# EAGLE design GPS Antenna Test (EAGLE 9.2.1)
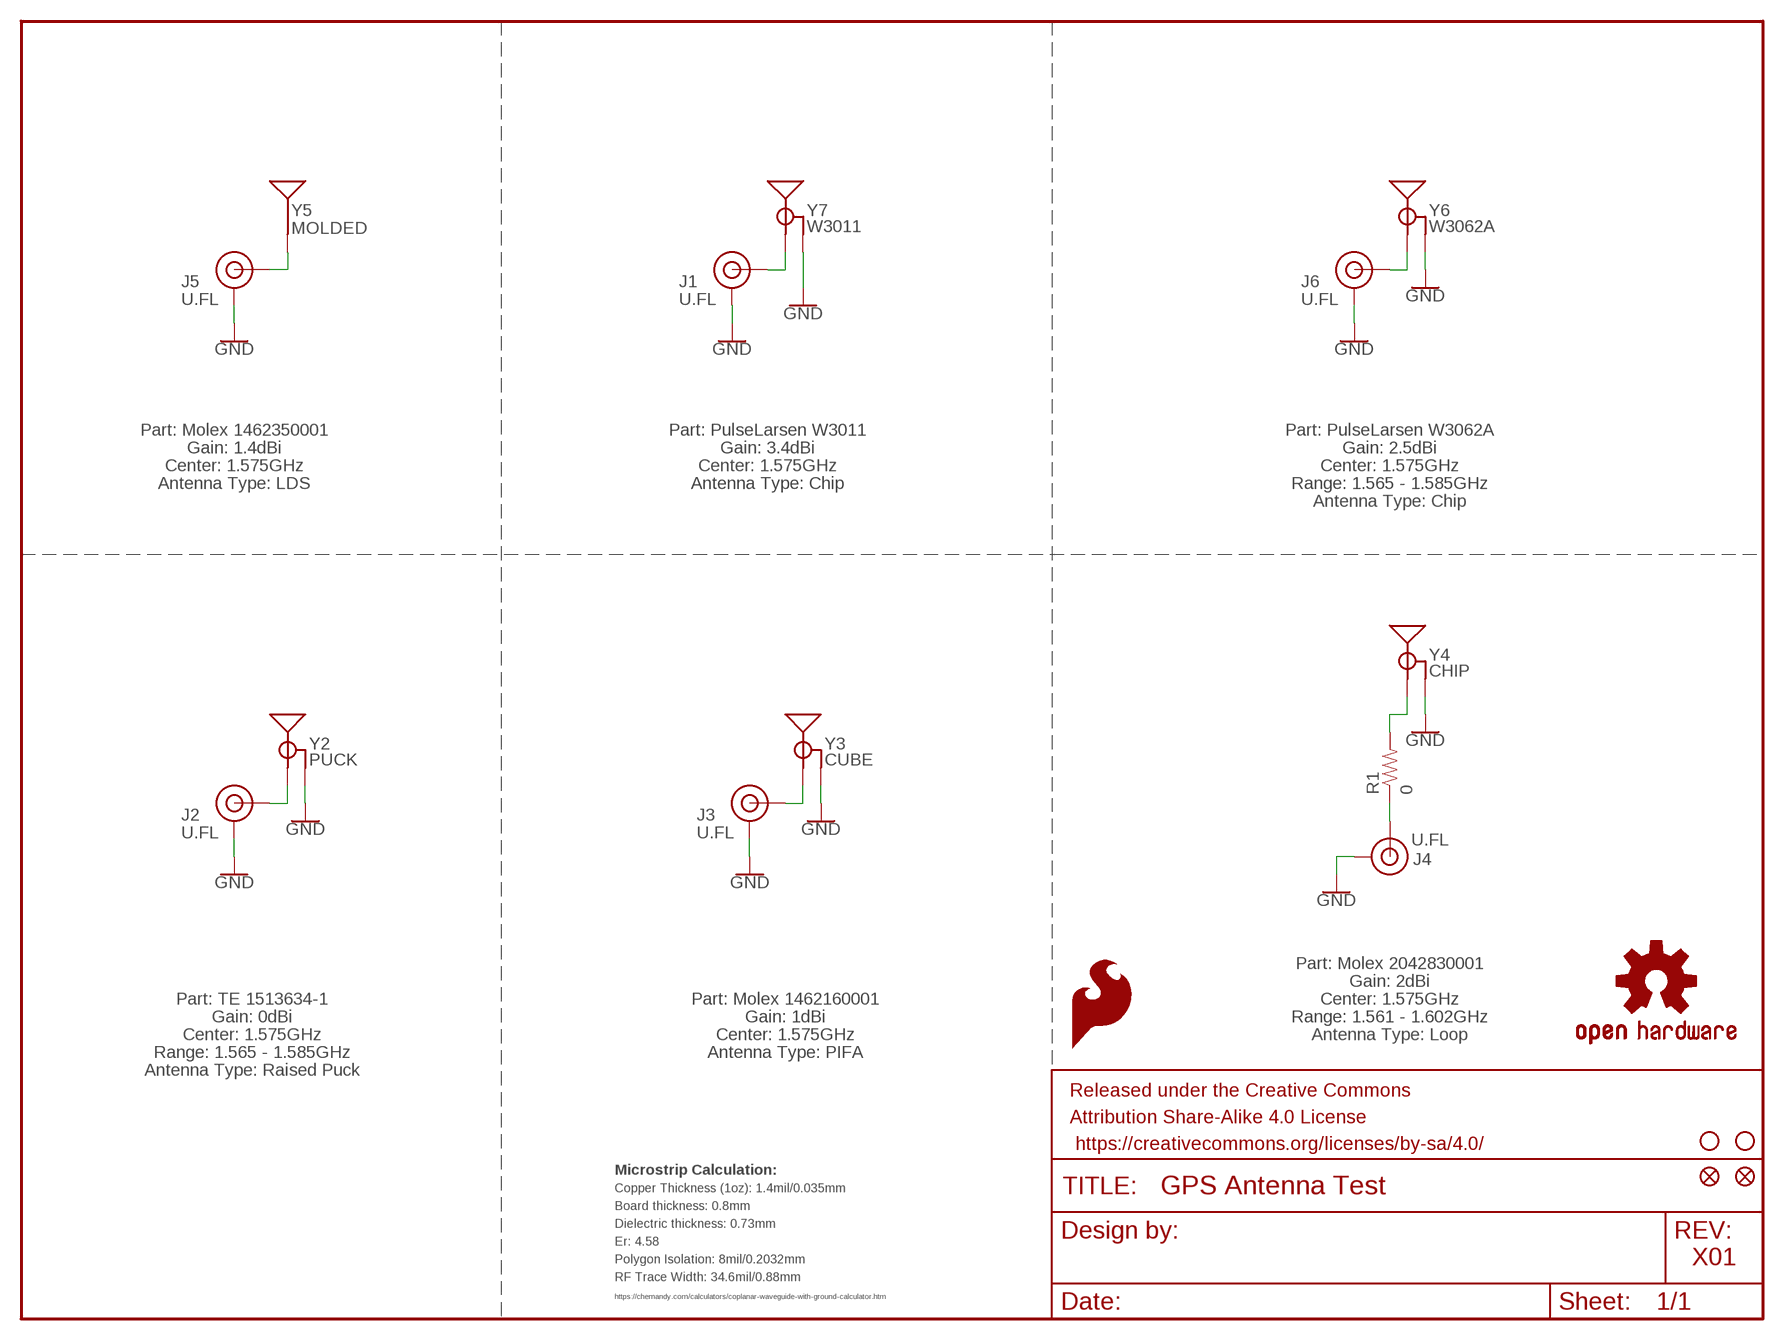
[diagram p0: schematic, sheet 1]

## Parts
FRAME1  FRAME-LETTER  [CREATIVE_COMMONS]
J1  U.FL  U.FL2PIN  [U.FL]
J2  U.FL  U.FL2PIN  [U.FL]
J3  U.FL  U.FL2PIN  [U.FL]
J4  U.FL  U.FL2PIN  [U.FL]
J5  U.FL  U.FL2PIN  [U.FL]
J6  U.FL  U.FL2PIN  [U.FL]
JP5  STAND-OFF  [STAND-OFF]
JP6  STAND-OFF  [STAND-OFF]
JP8  FIDUCIAL1X2  [FIDUCIAL-1X2]
JP9  FIDUCIAL1X2  [FIDUCIAL-1X2]
LOGO1  SFE_LOGO_FLAME.1EXP  [SFE_LOGO_FLAME_COPPER_EXPOSED_.1]
LOGO2  SFE_LOGO_FLAME.1EXP  [SFE_LOGO_FLAME_COPPER_EXPOSED_.1]
LOGO3  SFE_LOGO_FLAME.1EXP  [SFE_LOGO_FLAME_COPPER_EXPOSED_.1]
LOGO4  SFE_LOGO_FLAME.1EXP  [SFE_LOGO_FLAME_COPPER_EXPOSED_.1]
LOGO5  SFE_LOGO_FLAME.1EXP  [SFE_LOGO_FLAME_COPPER_EXPOSED_.1]
LOGO6  SFE_LOGO_FLAME.1EXP  [SFE_LOGO_FLAME_COPPER_EXPOSED_.1]
R1  0  RESISTOR0402-RES  [0402-RES]
U$16  OSHW-LOGOS  [OSHW-LOGO-S]
Y2  PUCK  GPS_CHIP_ANTENNAPUCK  [TE_PUCK]
Y3  CUBE  GPS_CHIP_ANTENNACUBE  [MOLEX_GNSS_CUBE]
Y4  CHIP  GPS_CHIP_ANTENNA2042830001  [MOLEX_GNSS_CHIP]
Y5  MOLDED  GPS_CHIP_ANTENNA_NOGNDMOLDED  [MLOEX_GNSS_MOLDED]
Y6  W3062A  GPS_CHIP_ANTENNAW3062A  [W3062A]
Y7  W3011  GPS_CHIP_ANTENNAW3011  [W3011]

## Nets
FEED1: J1.FEED(SIGNAL) Y7.1(SIGNAL)
FEED2: J5.FEED(SIGNAL) Y5.FEED(SIGNAL)
FEED3: J2.FEED(SIGNAL) Y2.S(SIGNAL)
FEED4: J3.FEED(SIGNAL) Y3.FEED(SIGNAL)
FEED5: J4.FEED(SIGNAL) R1.1
FEED6: J6.FEED(SIGNAL) Y6.FEED(SIGNAL)
GND: J1.1(GND) J1.2(GND) J2.1(GND) J2.2(GND) J3.1(GND) J3.2(GND) J4.1(GND) J4.2(GND) J5.1(GND) J5.2(GND) J6.1(GND) J6.2(GND) Y2.1(GND) Y2.2(GND) Y2.3(GND) Y3.GND Y4.1(GND) Y4.2(GND) Y4.3(GND) Y6.GND Y7.2(GND) Y7.3(GND)
N$5: R1.2 Y4.FEED(SIGNAL)

## Notes on the sheet
- Part: Molex 1462350001 | Part: PulseLarsen W3011 | Part: PulseLarsen W3062A
- Gain: 1.4dBi | Gain: 3.4dBi | Gain: 2.5dBi
- Center: 1.575GHz | Center: 1.575GHz | Center: 1.575GHz
- Antenna Type: LDS | Antenna Type: Chip | Range: 1.565 - 1.585GHz
- Antenna Type: Chip
- Part: Molex 2042830001
- Gain: 2dBi
- Part: TE 1513634-1 | Part: Molex 1462160001 | Center: 1.575GHz
- Gain: 0dBi | Gain: 1dBi | Range: 1.561 - 1.602GHz
- Center: 1.575GHz | Center: 1.575GHz | Antenna Type: Loop
- Range: 1.565 - 1.585GHz | Antenna Type: PIFA
- Antenna Type: Raised Puck
- Microstrip Calculation:
- Copper Thickness (1oz): 1.4mil/0.035mm
- Board thickness: 0.8mm
- Dielectric thickness: 0.73mm
- Er: 4.58
- Polygon Isolation: 8mil/0.2032mm | X01
- RF Trace Width: 34.6mil/0.88mm
- https://chemandy.com/calculators/coplanar-waveguide-with-ground-calculator.htm

## Library data of the parts
FRAME1 = SparkFun-Aesthetics:FRAME-LETTER: Schematic Frame - Letter Standard 8.5x11 US Letter frame
J1-J6 = SparkFun-Connectors:U.FL2PIN: SMD Antenna Connector - U.FL 2mm height, 3.0mm x 3.0mm receptacle size. SparkFun Products: SparkFun WiFi Shield - ESP8266 <https://www.sparkfun.com/products/13287> SparkFun ESP8266 Thing <https://www.sparkfun.com/products/13231> SparkFun MiniGen - Pro Mini Signal Generator Shield <https://www.sparkfun.com/products/11420>; PROD_ID: CONN-09193; SF_ID: WRL-09144
JP5 JP6 = SparkFun:STAND-OFF: Stand Off This is the mechanical footprint for a #4 phillips button head screw. Use the keepout ring to avoid running the screw head into surrounding components. SKU : PRT-00447
JP8 JP9 = SparkFun:FIDUCIAL: Fiducial Alignment Points Various fiducial points for machine vision alignment.
LOGO1-LOGO6 = SparkFun-Aesthetics:SFE_LOGO_FLAME: SparkFun Flame Logo This is the SparkFun flame logo. The logo on the schematic will always be the same size; the package variant is the height of the flame. Default layer for the logo on the board is tSilk.
R1 = Testing:RESISTOR: Resistor Basic schematic elements and footprints for 0603, 1206, and PTH resistors.
U$16 = SparkFun-Aesthetics:OSHW-LOGO: Open-Source Hardware (OSHW) Logo This logo indicates the piece of hardware it is found on incorporates a OSHW license and/or adheres to the definition of open source hardware found here: http://freedomdefined.org/OSHW
Y2-Y4 Y6 Y7 = GPS Chip Antennas:GPS_CHIP_ANTENNA
Y5 = GPS Chip Antennas:GPS_CHIP_ANTENNA_NOGND

## Net classes
1 power: width 0.178 mm

## Board
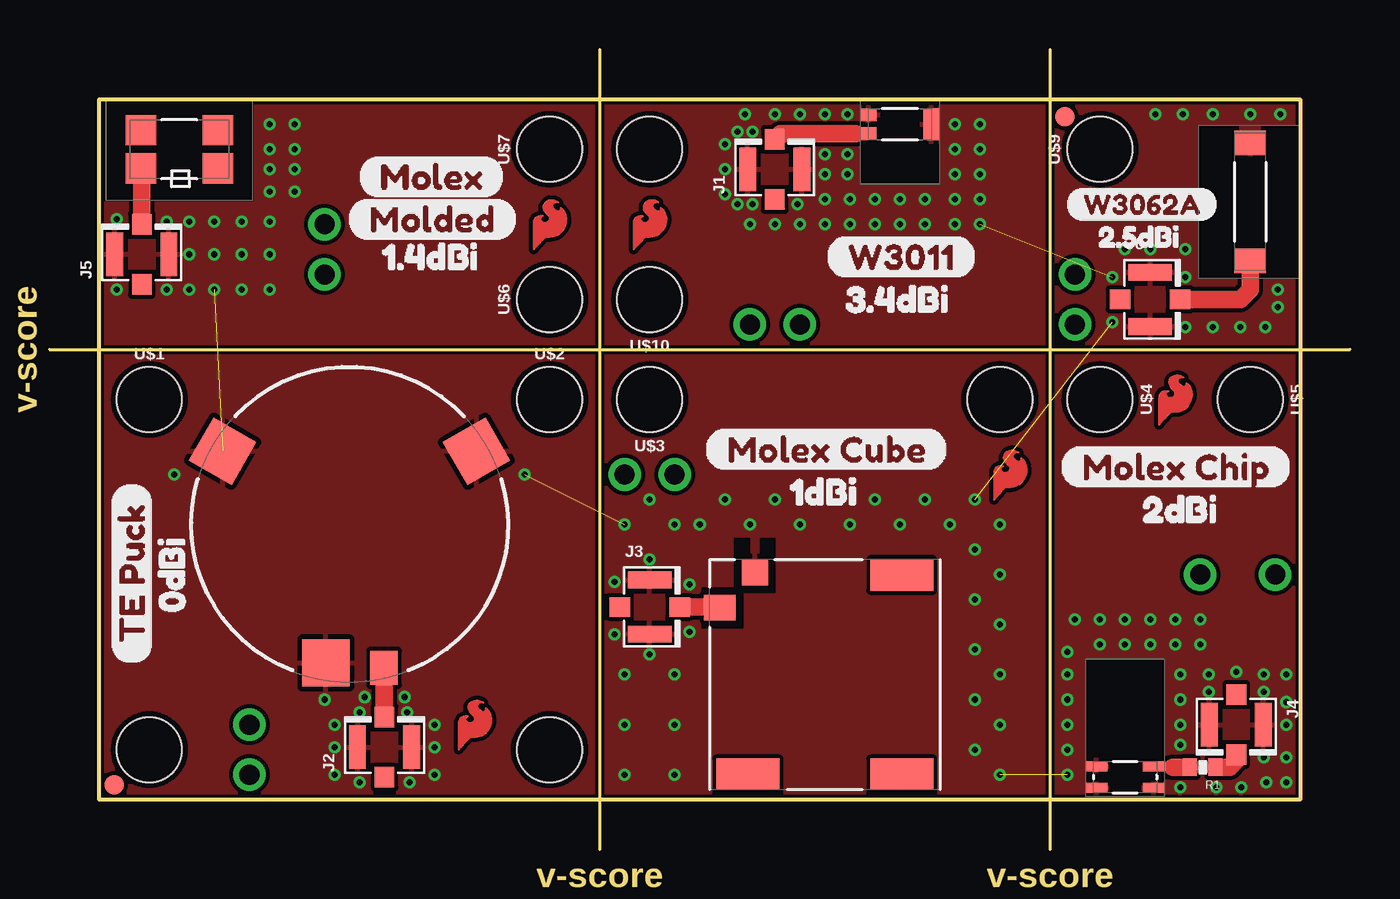
[diagram p1: board, top side]
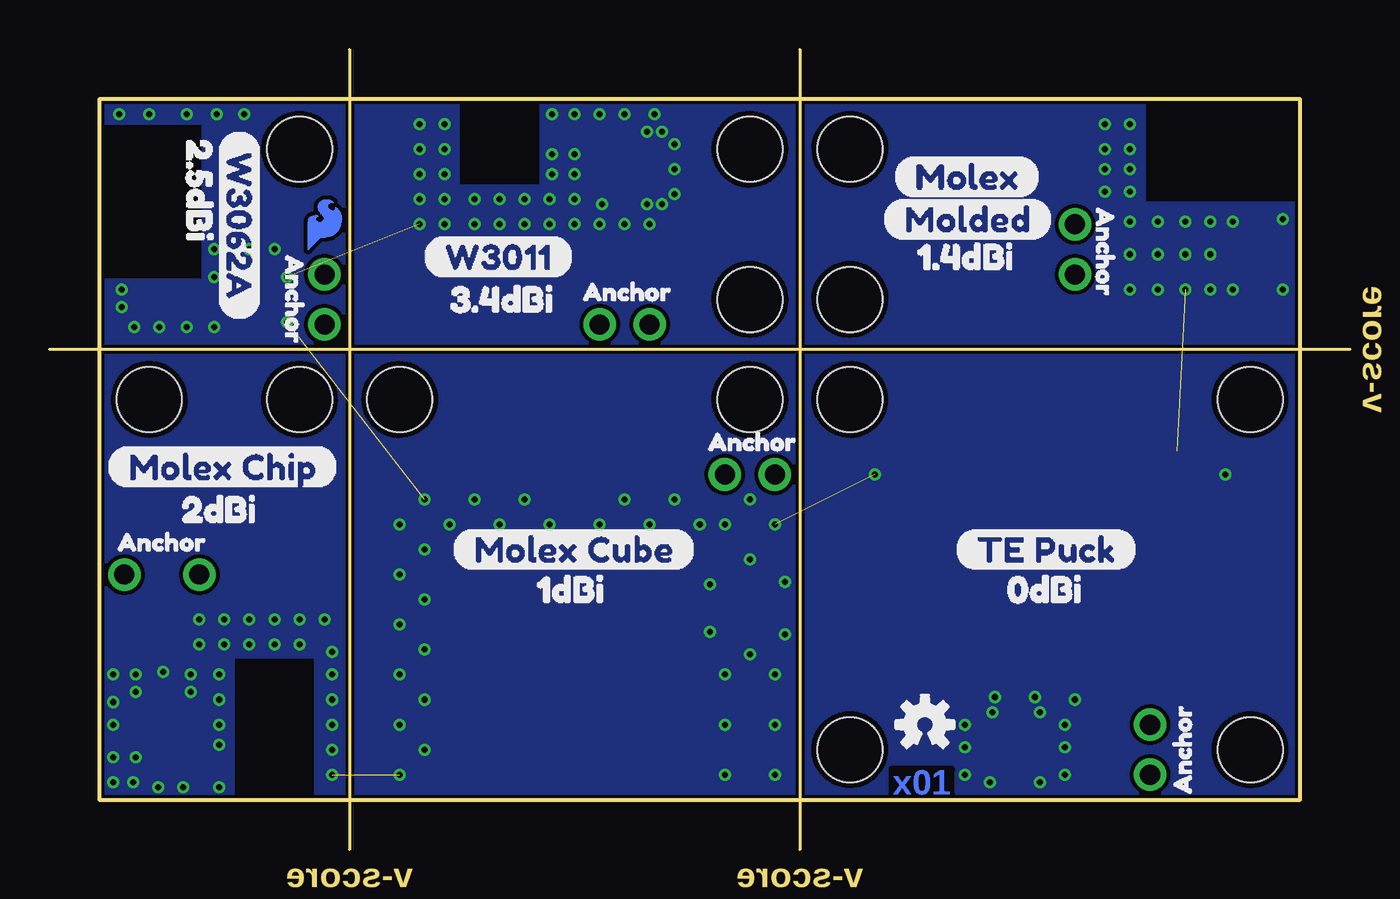
[diagram p2: board, bottom side, seen from below]

Size 66.04 x 40.64 mm. Coordinates in mm from the lower left corner, seen from the top.
Outline: 27.94,40.64 27.94,0
Outline: 50.8,40.64 50.8,0
Outline: 0,25.4 66.04,25.4
Outline: 2.54,38.1 63.5,38.1 63.5,2.54 2.54,2.54 2.54,38.1
Copper layers (1*16): Top 0.035mm / dielectric 1.5mm / Bottom 0.035mm
Design rules "SparkFun-2-layer-PCBWay-LIMIT *": minimum track width 6mil, minimum drill 0.3mm, track to track 8mil, track to pad 8mil, pad to pad 8mil, via to via 8mil, smd to smd 8mil, copper to edge 6mil, drill to drill 6mil, minimum pad ring 6mil, minimum via ring 6mil, stop-mask expansion 4mil, vias tented up to drill 25mil, thermal gap 10mil
vRestrict: area 5.7,24.9 to 7.1,33.1; area 10.8,25.7 to 12.4,33.1; area 53,13.3 to 53.6,13.8; area 55.5,13.2 to 56,14.1; area 16.4,31.9 to 17.8,34.2; area 5.3,15.5 to 14.5,27.6

### Footprints (pad centres in the part's own frame; a part is rotated, then mirrored left to right if it is on the bottom)
U.FL = smd 2.2 x 0.85: 1 0,1.375; 2 0,-1.375 | smd 1.05 x 1: FEED 1.525,0; NC -1.525,0
STAND-OFF = hole 3.302: 0,0
FIDUCIAL-1X2 = smd 1 x 1: 1 0,0
0402-RES = smd 0.7 x 0.9: 1 -0.65,0; 2 0.65,0
TE_PUCK = smd 2.4 x 2.4: 1 -1.2,-7.03 | smd 2.5 x 2.5 rotated 60: 2 -6.443,3.72 | smd 2.5 x 2.5 rotated 300: 3 6.443,3.72 | smd 1.4 x 1.74: S 1.75,-7.28
MOLEX_GNSS_CUBE = smd 1.61 x 1.3: FEED 5.33,-3.4 | smd 1.3 x 1.32: GND 3.545,-5.2 | smd 3.2 x 1.6: NC1 -3.905,-5.06; NC2 -3.905,5.06; NC3 3.905,5.06
MOLEX_GNSS_CHIP = smd 1.1 x 0.5: 1 1.45,-0.55; 2 -1.45,-0.55; 3 -1.45,0.55; FEED 1.45,0.55
MLOEX_GNSS_MOLDED = smd 1.54 x 1.54: 1 -0.97,-1.95; 2 -0.97,1.95; 3 0.97,1.95; FEED 0.97,-1.95
W3062A = smd 1.25 x 1.61: FEED 3,0; GND -3,0
W3011 = smd 0.8 x 0.65: 1 1.6,0.475; 2 1.6,-0.475 | smd 0.8 x 1.6: 3 -1.6,0

### Placement (x,y rotation side)
FRAME1  0,-35.56 0 top  (outside the outline)
J1  36.83,34.54 90 top
J2  17.02,5.21 90 top
J3  30.48,12.32 0 top
J4  60.26,6.35 270 top
J5  4.7,30.23 90 top
J6  55.88,27.94 0 top
JP1  STAND-OFF  [STAND-OFF]  25.4,5.08 0 top
JP2  STAND-OFF  [STAND-OFF]  5.08,5.08 0 top
JP5  48.26,22.86 180 top
JP6  30.48,35.56 180 top
JP8  51.56,37.21 0 top
JP9  3.3,3.3 0 top
LOGO1  52.07,31.75 0 bottom
LOGO2  57.15,22.86 0 top
LOGO3  30.48,31.75 0 top
LOGO4  25.4,31.75 0 top
LOGO5  48.77,19.05 0 top
LOGO6  21.59,6.35 0 top
R1  58.55,4.19 180 top
U$1  [STAND-OFF]  5.08,22.86 0 top
U$2  [STAND-OFF]  25.4,22.86 0 top
U$3  [STAND-OFF]  30.48,22.86 180 top
U$4  [STAND-OFF]  53.34,22.86 270 top
U$5  [STAND-OFF]  60.96,22.86 270 top
U$6  [STAND-OFF]  25.4,27.94 90 top
U$7  [STAND-OFF]  25.4,35.56 90 top
U$8  [ANCHOR0]  12.45,33.4 270 bottom
U$9  [STAND-OFF]  53.34,35.56 90 top
U$10  [STAND-OFF]  30.48,27.94 180 top
U$11  [3#4DBI2]  39.24,27.94 0 top
U$12  [0DBI0]  6.22,10.92 90 top
U$13  [W30111]  39.37,30.1 0 top
U$14  [1#4DBI3]  15.75,30.1 0 top
U$15  [1DBI1]  36.45,18.16 0 top
U$16  21.59,6.35 0 bottom
U$18  [2DBI2]  54.36,17.27 0 top
U$19  [MOLEX_CHIP7]  51.31,19.43 0 top
U$20  [MOLEX_CUBE6]  33.27,20.32 0 top
U$21  [MOLEX1]  23.24,34.16 0 bottom
U$22  [TE_PUCK5]  4.19,9.4 90 top
U$24  [ANCHOR0]  8.51,2.03 90 bottom
U$25  [ANCHOR0]  33.4,20.7 0 bottom
U$26  [ANCHOR0]  39.75,28.32 0 bottom
U$27  [ANCHOR0]  63.37,15.62 0 bottom
U$28  [ANCHOR0]  53.59,30.99 270 bottom
U$29  [MOLDED2]  15.11,32 0 top
U$30  [MOLEX1]  15.62,34.16 0 top
U$31  [MOLDED2]  23.75,32 0 bottom
U$32  [1#4DBI3]  23.11,30.1 0 bottom
U$33  [W30111]  47.12,30.1 0 bottom
U$34  [3#4DBI2]  46.86,27.94 0 bottom
U$35  [W3062A9]  56.39,36.58 270 bottom
U$36  [2#5DBI4]  58.42,37.21 270 bottom
U$37  [MOLEX_CHIP7]  63.12,19.43 0 bottom
U$38  [2DBI2]  60.45,17.27 0 bottom
U$39  [1DBI1]  42.42,13.21 0 bottom
U$40  [MOLEX_CUBE6]  45.59,15.24 0 bottom
U$41  [TE_PUCK5]  20.07,15.24 0 bottom
U$42  [0DBI0]  18.54,13.21 0 bottom
U$44  [2#5DBI2]  52.32,31.11 0 top
U$45  [W3062A1]  51.56,32.77 0 top
Y2  15.24,16.51 0 top
Y3  39.37,8.89 180 top
Y4  54.61,3.68 0 top
Y5  6.6,35.56 270 top
Y6  60.96,32.89 270 top
Y7  43.18,36.83 180 top

### Tracks (layer width: path | path; a pad name or v marks a point on that pad's centre or on a via)
A1  (via drill 1.02 pad 1.65)
  other vias: 13.97,31.75
FEED1
  Top 0.152: 41.33,36.35 Y7.1
  Top 0.203: 40.93,36.35 Y7.1
  Top 0.879: J1.FEED 37.12,36.35 40.93,36.35
FEED2
  Top 0.203: Y5.FEED 4.7,34.55 | 4.7,34.55 | J5.FEED
  Top 0.879: J5.FEED 4.7,34.55 Y5.FEED
FEED3
  Top 0.879: J2.FEED 16.99,6.76 Y2.S
FEED4
  Top 0.203: Y3.FEED 34.01,12.32 33.9,12.32
  Top 0.879: 33.93,12.29 33.9,12.32 J3.FEED
FEED5
  Top 0.879: R1.1 59.92,4.19 60.26,4.53 J4.FEED
FEED6
  Top 0.879: J6.FEED 60.45,27.94 60.96,28.45 Y6.FEED
GND  (via drill 0.3)  (5 unrouted)
  other vias: 45.97,36.83 45.97,35.56 45.97,34.29 45.97,33.02 45.97,31.75 44.45,33.02 43.18,33.02 44.45,31.75 41.91,33.02 40.64,33.02 39.37,33.02 37.97,32.77 36.83,31.75 35.56,31.75 35.69,32.77 34.92,32.77 40.51,34.29 39.37,34.29 40.51,35.31 39.37,35.31 40.51,37.34 39.37,37.34 38.1,37.34 36.83,37.34 35.69,36.45 34.92,36.45 14.48,6.35 14.48,3.81 15.75,3.43 15.75,6.99 16,7.75 18.03,7.75 18.16,6.99 19.56,5.21 14.48,5.21 19.56,6.35 19.56,3.81 18.29,3.43 38.1,16.51 40.64,16.51 43.18,16.51 45.72,16.51 48.26,16.51 48.26,13.97 48.26,11.43 48.26,8.89 48.26,6.35 48.26,3.81 35.56,16.51 33.02,16.51 31.75,16.51 29.21,8.89 31.75,8.89 31.75,6.35 29.21,6.35 29.21,3.81 31.75,3.81 32.51,13.46 32.51,11.05 28.7,10.92 28.7,13.59 30.48,14.73 30.48,9.91 51.69,3.81 51.69,5.08 51.69,6.35 51.69,7.62 51.69,8.89 51.69,10.03 53.34,10.41 54.61,10.41 55.88,10.41 57.15,10.41 57.4,8.89 57.4,7.62 57.4,6.35 57.4,5.33 58.86,8 61.65,8 62.8,6.35 61.65,4.7 62.8,4.7 62.8,7.49 57.4,3.17 59.24,3.17 60.51,3.17 61.78,3.43 62.8,3.43 58.86,8.89 60.26,9.02 61.65,8.89 62.8,8.89 3.43,28.45 35.31,37.34 5.97,28.45 5.97,31.88 3.43,32 7.11,30.23 7.11,28.45 7.11,31.88 8.38,31.88 9.78,31.88 11.18,31.88 11.18,33.4 11.18,35.56 11.18,36.83 8.38,30.23 9.78,30.23 11.18,30.23 8.38,28.45 9.78,28.45 11.18,28.45 11.18,34.54 12.45,36.83 12.45,35.56 12.45,34.54 12.45,33.4 6.35,19.05 24.13,19.05 13.97,7.62 46.99,15.24 46.99,12.7 46.99,10.16 46.99,7.62 46.99,5.08 44.45,17.78 41.91,17.78 36.83,17.78 34.29,17.78 30.48,17.78 46.99,17.78 53.34,11.68 54.61,11.68 55.88,11.68 57.15,11.68 52.07,11.68 58.42,11.68 58.42,10.41 43.18,31.75 41.91,31.75 40.64,31.75 39.37,31.75 38.1,31.75 47.24,31.75 47.24,33.02 47.24,34.29 47.24,35.56 47.24,36.83 34.29,34.54 34.29,35.81 34.29,33.27 57.66,26.54 57.66,29.08 55.88,30.48 57.66,30.48 54.61,30.48 53.98,29.08 53.98,26.8 59.05,26.54 60.45,26.54 61.72,26.54 62.36,27.56 62.36,28.45 62.48,37.34 60.96,37.34 59.05,37.34 57.53,37.34 56.13,37.34 29.21,16.51
  pour Top (rank 2): 50.8,25.4 27.94,25.4 27.94,38.1 50.8,38.1
  pour Bottom (rank 2): 50.8,25.4 27.94,25.4 27.94,38.1 50.8,38.1
  pour Top (no thermals): 44.58,36.07 45.21,36.07 45.21,35.56 46.1,35.56 46.1,38.1 45.21,38.1 45.21,37.59 44.58,37.59
  pour Top (no thermals): 41.78,37.06 40.77,37.06 40.77,37.85 41.15,37.85 41.15,37.54 41.78,37.54
  pour Top: 2.54,25.4 27.94,25.4 27.94,2.54 2.54,2.54
  pour Bottom: 2.54,25.4 27.94,25.4 27.94,2.54 2.54,2.54
  pour Bottom: 50.8,2.54 27.94,2.54 27.94,25.4 50.8,25.4
  pour Top: 50.8,2.54 27.94,2.54 27.94,25.4 50.8,25.4
  pour Top: 50.8,25.4 63.5,25.4 63.5,2.54 50.8,2.54
  pour Bottom: 50.8,25.4 63.5,25.4 63.5,2.54 50.8,2.54
  pour Top (no thermals): 52.8,4.44 52.59,4.44 52.59,4.84 52,4.84 52,3.74 52.59,3.74 52.59,4.04 52.8,4.04
  pour Top (no thermals): 52.77,3.34 52.59,3.34 52.59,3.73 51.94,3.73 51.94,2.64 52.59,2.64 52.59,2.94 52.77,2.94
  pour Bottom: 2.54,25.4 2.54,38.1 27.94,38.1 27.94,25.4
  pour Top: 2.54,25.4 2.54,38.1 27.94,38.1 27.94,25.4
  pour Top: 50.8,25.4 50.8,38.1 63.5,38.1 63.5,25.4
  pour Bottom: 50.8,25.4 50.8,38.1 63.5,38.1 63.5,25.4
  pour Top (no thermals): 56.59,3.34 56.59,3.54 57.34,3.54 57.34,2.74 56.59,2.74 56.59,2.89 56.24,2.89 56.24,3.34
  pour Top (no thermals): 60.1,36.84 60.4,36.84 60.4,36.24 61.5,36.24 61.5,36.84 61.9,36.84 61.9,37.04 60.1,37.04
N$1  (via drill 1.02 pad 1.65)
  other vias: 35.56,26.67
N$5
  Top 0.203: 57.02,4.19 57.02,4.2 56.99,4.23
  Top 0.483: 56.99,4.23 Y4.FEED
  Top 0.879: R1.2 57.02,4.19
N$8  (via drill 1.02 pad 1.65)
  other vias: 10.16,6.35
N$10  (via drill 1.02 pad 1.65)
  other vias: 52.07,29.21
N$11  (via drill 1.02 pad 1.65)
  other vias: 52.07,26.67
N$13  (via drill 1.02 pad 1.65)
  other vias: 13.97,29.21
N$14  (via drill 1.02 pad 1.65)
  other vias: 10.16,3.81
N$16  (via drill 1.02 pad 1.65)
  other vias: 58.42,13.97
N$17  (via drill 1.02 pad 1.65)
  other vias: 62.23,13.97
N$18  (via drill 1.02 pad 1.65)
  other vias: 38.1,26.67
N$19  (via drill 1.02 pad 1.65)
  other vias: 31.75,19.05
N$20  (via drill 1.02 pad 1.65)
  other vias: 29.21,19.05

### Text on the board
Bottom: x01
Dimension: v-score | v-score | v-score
tDocu: 0.8mm Board Thickness
214bmp: D:/SmartProjects/Snc/a4_bn_logo2.bmp